# Altium schematic sheet cpu.SchDoc
size A4
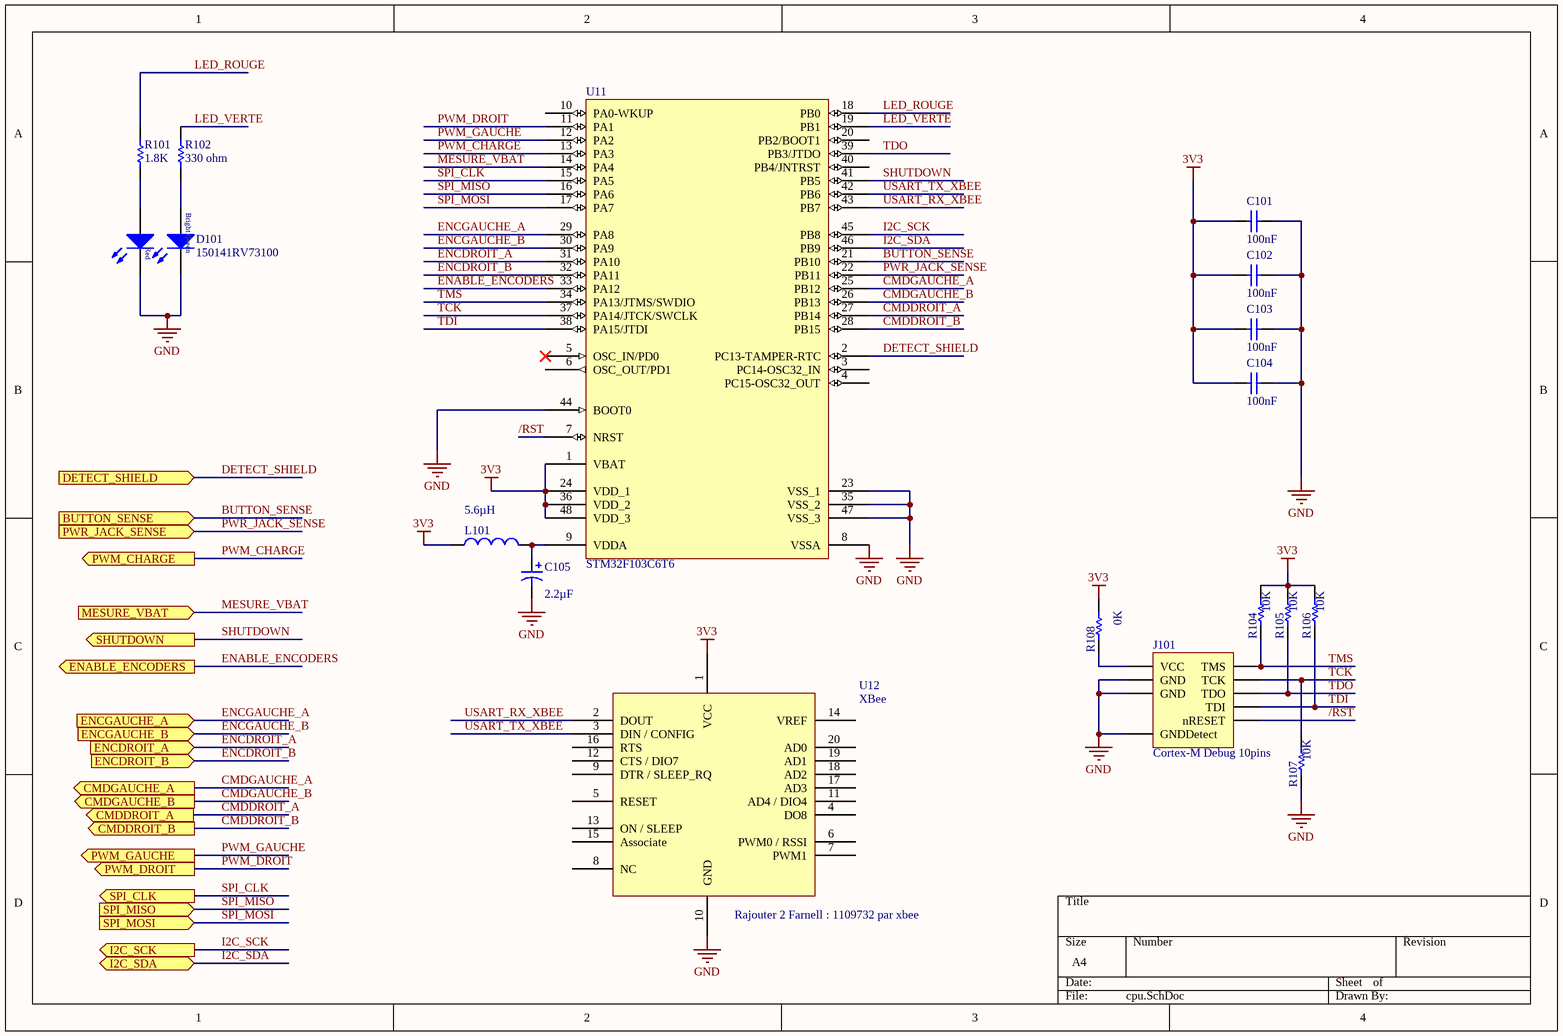
[diagram p0: cpu.SchDoc]

## Parts
C101  value 100nF  [CAPC1206(3216)170_L]  (hidden comment: CAP 100nF)
C102  value 100nF  [CAPC1206(3216)170_L]  (hidden comment: CAP 100nF)
C103  value 100nF  [CAPC1206(3216)170_L]  (hidden comment: CAP 100nF)
C104  value 100nF  [CAPC1206(3216)170_L]  (hidden comment: CAP 100nF)
C105  value 2.2µF  [B]  (hidden comment: T491B)
D101  150141RV73100  [3528_A]
J101  Cortex-M Debug 10pins  [Cortex M Debug]
L101  value 5.6µH  [1812]  (hidden comment: Inductor)
R101  value 1.8K  [RESC0805(2012)_N]  (hidden comment: 1K8 5% 0805(2012))
R102  value 330 ohm  [RESC0805(2012)_L]  (hidden comment: 330R 5% 0805(2012))
R104  10K  [RESC1206(3216)_M]
R105  10K  [RESC1206(3216)_M]
R106  10K  [RESC1206(3216)_M]
R107  10K  [RESC1206(3216)_M]
R108  value 0K  [RESC1206(3216)_M]  (hidden comment: 10K)
U11  STM32F103C6T6  [LQFP48_N]
U12  XBee  [XBee]

## Ports
BUTTON_SENSE (in), CMDDROIT_A (out), CMDDROIT_B (out), CMDGAUCHE_A (out), CMDGAUCHE_B (out), DETECT_SHIELD (in), ENABLE_ENCODERS (out), ENCDROIT_A (in), ENCDROIT_B (in), ENCGAUCHE_A (in), ENCGAUCHE_B (in), I2C_SCK (out), I2C_SDA (bidir), MESURE_VBAT (in), PWM_CHARGE (out), PWM_DROIT (out), PWM_GAUCHE (out), PWR_JACK_SENSE (in), SHUTDOWN (out), SPI_CLK (out), SPI_MISO (in), SPI_MOSI (in)

## Nets
3V3: C101.2 C102.2 C103.2 C104.2 L101.1 R104.2 R105.2 R106.2 R108.2 U11.1(VBAT) U11.24(VDD_1) U11.36(VDD_2) U11.48(VDD_3) U12.1(VCC)
GND: C101.1 C102.1 C103.1 C104.1 C105.2 D101.3(C) D101.4(C) J101.3(GND) J101.5(GND) J101.9(GNDDetect) R107.1 U11.8(VSSA) U11.23(VSS_1) U11.35(VSS_2) U11.44(BOOT0) U11.47(VSS_3) U12.10(GND)
/RST: J101.10(nRESET) U11.7(NRST)
BUTTON_SENSE: U11.21(PB10) ; port BUTTON_SENSE
CMDDROIT_A: U11.27(PB14) ; port CMDDROIT_A
CMDDROIT_B: U11.28(PB15) ; port CMDDROIT_B
CMDGAUCHE_A: U11.25(PB12) ; port CMDGAUCHE_A
CMDGAUCHE_B: U11.26(PB13) ; port CMDGAUCHE_B
DETECT_SHIELD: U11.2(PC13-TAMPER-RTC) ; port DETECT_SHIELD
ENABLE_ENCODERS: U11.33(PA12) ; port ENABLE_ENCODERS
ENCDROIT_A: U11.31(PA10) ; port ENCDROIT_A
ENCDROIT_B: U11.32(PA11) ; port ENCDROIT_B
ENCGAUCHE_A: U11.29(PA8) ; port ENCGAUCHE_A
ENCGAUCHE_B: U11.30(PA9) ; port ENCGAUCHE_B
I2C_SCK: U11.45(PB8) ; port I2C_SCK
I2C_SDA: U11.46(PB9) ; port I2C_SDA
LED_ROUGE: R101.2 U11.18(PB0)
LED_VERTE: R102.2 U11.19(PB1)
MESURE_VBAT: U11.14(PA4) ; port MESURE_VBAT
PWM_CHARGE: U11.13(PA3) ; port PWM_CHARGE
PWM_DROIT: U11.11(PA1) ; port PWM_DROIT
PWM_GAUCHE: U11.12(PA2) ; port PWM_GAUCHE
PWR_JACK_SENSE: U11.22(PB11) ; port PWR_JACK_SENSE
SHUTDOWN: U11.41(PB5) ; port SHUTDOWN
SPI_CLK: U11.15(PA5) ; port SPI_CLK
SPI_MISO: U11.16(PA6) ; port SPI_MISO
SPI_MOSI: U11.17(PA7) ; port SPI_MOSI
TCK: J101.4(TCK) R107.2 U11.37(PA14/JTCK/SWCLK)
TDI: J101.8(TDI) R106.1 U11.38(PA15/JTDI)
TDO: J101.6(TDO) R105.1 U11.39(PB3/JTDO)
TMS: J101.2(TMS) R104.1 U11.34(PA13/JTMS/SWDIO)
USART_RX_XBEE: U11.43(PB7) U12.2(DOUT)
USART_TX_XBEE: U11.42(PB6) U12.3(DIN_/_CONFIG)
NetC105_1: C105.1 L101.2 U11.9(VDDA)
NetD101_1: D101.1(A) R101.1
NetD101_2: D101.2(A) R102.1
NetJ101_1: J101.1(VCC) R108.1

Not connected (* = marked no-connect by the designer): U11 3(PC14-OSC32_IN) 4(PC15-OSC32_OUT) 5(OSC_IN/PD0)* 6(OSC_OUT/PD1) 10(PA0-WKUP) 20(PB2/BOOT1) 40(PB4/JNTRST); U12 4(DO8) 5(RESET) 6(PWM0_/_RSSI) 7(PWM1) 8(NC) 9(DTR_/_SLEEP_RQ) 11(AD4_/_DIO4) 12(CTS_/_DIO7) 13(ON_/_SLEEP) 14(VREF) 15(Associate) 16(RTS) 17(AD3) 18(AD2) 19(AD1) 20(AD0)

## Notes on the sheet
- (near U12) Rajouter 2 Farnell : 1109732 par xbee
- (in symbol CMP-1430-00001-1) Bright Green; Red

## Library data of the parts
C101-C104 = CMP-1037-04201-1: CAP 100nF 50V ±10% 1206 (3216 Metric) Thickness 1.7mm SMD; Case-Metric: 3216; Tolerance: Â±10%; Case-EIA: 1206; Max Thickness: 1.7 mm; Rated Voltage: 50 V; Technology: SMT
C105 = T491B: Solid Tantalum Chip Capacitor, Standard T491 Series - Industrial Grade; Published: 17-Jul-2002; LatestRevisionDate: 19-Mar-2004; LatestRevisionNote: Silkscreen dimensions re-sized.; DatasheetDocument: Mar-2001; PackageDocument: Mar-2001; PackageReference: B; Publisher: Altium Limited; Code_JEITA: 3528-21; ComponentLink1Description: Manufacturer Link; ComponentLink1URL: http://www.kemet.com/; ComponentLink2Description: Datasheet; ComponentLink2URL: http://www.kemet.com/kemet/web/homepage/kechome.nsf/vapubfilesname/F3102TA.pdf/$file/F3102TA.pdf
D101 = CMP-1430-00001-1: SMD Bi-Color Top LED, WL-SBTW, Red & Bright Green; Manufacturer: Wuerth Elektronik; PartNumber: 150141RV73100; ComponentLink1Description: Manufacturer URL; ComponentLink2Description: Datasheet; ComponentLink2URL: http://katalog.we-online.com/led/datasheet/150141RV73100.pdf; Color: Red & Bright Green; ComponentLink1URL: http://www.we-online.com; PackageReference: 3528_A; Distributeur: Farnell : 2322113
L101 = Inductor: Inductor SMD; Code_IEC: 1005; Published: 8-Jun-2000; LatestRevisionDate: 29-May-2009; LatestRevisionNote: IPC-7351 Footprint Added.; PackageReference: 0402-A; Publisher: Altium Limited; PackageDescription: Chip Inductor; Code_JEITA: 0402
R101 = CMP-1013-00080-1: 1K8 0.125W 5% 0805 (2012 Metric)  SMD; Case-EIA: 0805; Case-Metric: 2012; Technology: SMT; Power: 0.125 W; Tolerance: 5 %
R102 = CMP-1013-00062-1: 330R 0.125W 5% 0805 (2012 Metric)  SMD; Case-EIA: 0805; Case-Metric: 2012; Tolerance: 5 %; Power: 0.125 W; Technology: SMT
R104-R108 = CMP-1014-00098-1: 10K 0.25W 5% 1206 (3216 Metric)  SMD; Case-Metric: 3216; Case-EIA: 1206; Power: 0.25 W; Tolerance: 5 %; Technology: SMT
  R104-R107: Value: 10K
U11 = STM32F103C6T6: STM32 ARM-based 32-bit MCU with 32 Kbytes Flash, 48-pin LQFP, Industrial Temperature; Published: 30-May-2008; DatasheetVersion: rev6, Mar-2008; PackageVersion: Mar-2008; PackageReference: LQFP48; Publisher: Altium Limited; PackageDescription: 48-Pin Low-Profile Quad Flat Pack, 7 x 7 mm Body, 0.5 mm Pitch (LQFP48); ComponentLink1Description: Manufacturer Link; ComponentLink1URL: www.st.com/stm32; ComponentLink2Description: Datasheet; ComponentLink2URL: http://www.st.com/stonline/products/literature/ds/13587.pdf; Distributeur: Farnell : 1972391
U12 = XBee: Xbee RF transceiver from Digi
J101 = Cortex-M Debug 10pins: Distributeur: Farnell : 1667729